# EAGLE design 1u_debug_breakout (EAGLE 9.3.2)
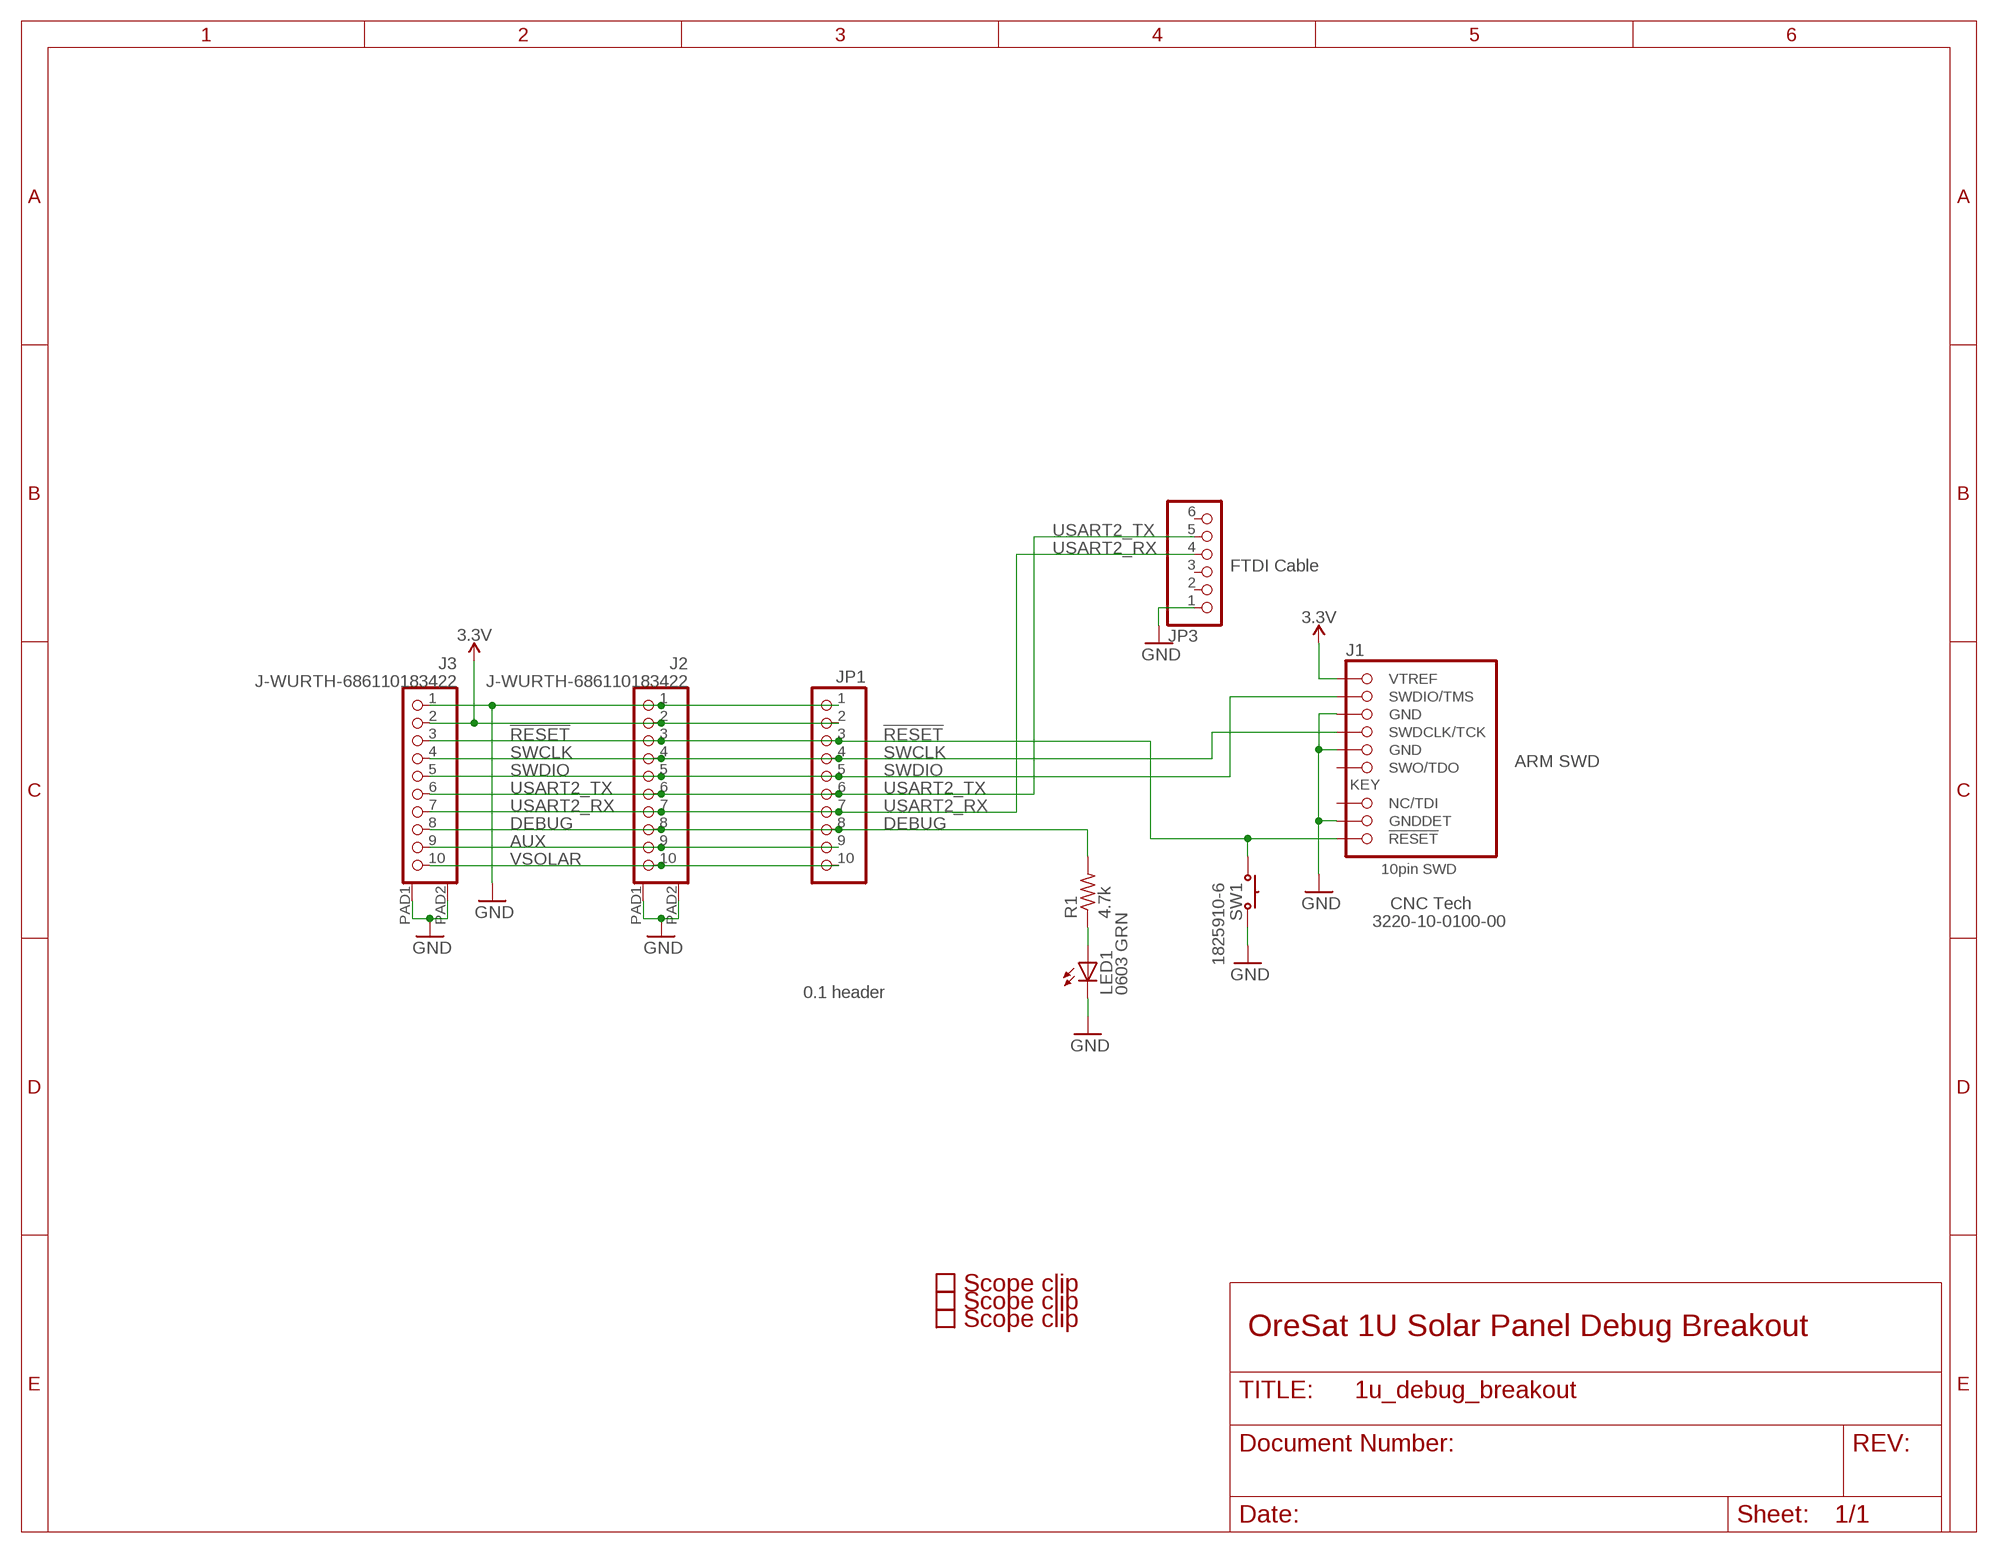
[diagram p0: schematic, sheet 1]

## Parts
J1  1.27MM-SWD-CONNECTOR  [1.27MM_2X5]
J2  J-WURTH-686110183422  [J-WURTH-686110183422]
J3  J-WURTH-686110183422  [J-WURTH-686110183422]
JP1  PINHD-1X10  [1X10]
JP3  PINHD-1X6  [1X06]
LED1  0603 GRN  LEDCHIPLED_0603  [CHIPLED_0603]
R1  4.7k  R-US_R0603  [R0603]
SW1  1825910-6  [SWITCH_FSM4JAH]
U$1  SCOPE_CLIP  [SCOPE_CLIP]
U$2  SCOPE_CLIP  [SCOPE_CLIP]
U$3  SCOPE_CLIP  [SCOPE_CLIP]

## Nets
3.3V: J1.VTREF J2.2 J3.2 JP1.2
!RESET: J1.!RESET J2.3 J3.3 JP1.3 SW1.1 SW1.2
AUX: J2.9 J3.9 JP1.9
DEBUG: J2.8 J3.8 JP1.8 R1.2
GND: J1.GND J1.GND@2(GND) J1.GNDDET J2.1 J2.PAD1 J2.PAD2 J3.1 J3.PAD1 J3.PAD2 JP1.1 JP3.1 LED1.C SW1.3 SW1.4
N$1: LED1.A R1.1
SWCLK: J1.SWDCLK(SWDCLK/TCK) J2.4 J3.4 JP1.4
SWDIO: J1.SWDIO(SWDIO/TMS) J2.5 J3.5 JP1.5
USART2_RX: J2.7 J3.7 JP1.7 JP3.4
USART2_TX: J2.6 J3.6 JP1.6 JP3.5
VSOLAR: J2.10 J3.10 JP1.10
Unconnected: J1.NC(NC/TDI) J1.SWO(SWO/TDO) JP3.2 JP3.3 JP3.6

## Notes on the sheet
- FTDI Cable
- ARM SWD
- 0.1 header
- OreSat 1U Solar Panel Debug Breakout

## Library data of the parts
J1 = J-CNC-3220-10-0100-00-ARM-SWD-port:1.27MM-SWD-CONNECTOR: ARM SWD Programming Header. Example part is the CNC 3220-10-0100-00; DIS: Digi-Key; DPN: 1175-1627-ND; MFR: CNC Tech; MPN: 3220-10-0100-00
J2 J3 = J-Wurth-686110183422-10pos-FFC:J-WURTH-686110183422
JP1 = pinhead:PINHD-1X10: PIN HEADER
JP3 = pinhead:PINHD-1X6: PIN HEADER
LED1 = led:LED: LED OSRAM: - CHIPLED LG R971, LG N971, LY N971, LG Q971, LY Q971, LO R971, LY R971 LH N974, LH R974 LS Q976, LO Q976, LY Q976 LO Q996 - Hyper CHIPLED LW Q18S LB Q993, LB Q99A, LB R99A - SideLED LS A670, LO A670, LY A670, LG A670, LP A670 LB A673, LV A673, LT A673, LW A673 LH A674 LY A675 LS A676, LA A676, LO A676, LY A676, LW A676 LS A679, LY A679, LG A679 - Hyper Micro SIDELED® LS Y876, LA Y876, LO Y876, LY Y876 LT Y87S - SmartLED LW L88C, LW L88S LB L89C, LB L89S, LG L890 LS L89K, LO L89K, LY L89K LS L896, LA L896, LO L896, LY L896 - TOPLED LS T670, LO T670, LY T670, LG T670, LP T670 LSG T670, LSP T670, LSY T670, LOP T670, LYG T670 LG T671, LOG T671, LSG T671 LB T673, LV T673, LT T673, LW T673 LH T674 LS T676, LA T676, LO T676, LY T676, LB T676, LH T676, LSB T676, LW T676 LB T67C, LV T67C, LT T67C, LS T67K, LO T67K, LY T67K, LW E67C LS E67B, LA E67B, LO E67B, LY E67B, LB E67C, LV E67C, LT E67C LW T67C LS T679, LY T679, LG T679 LS T770, LO T770, LY T770, LG T770, LP T770 LB T773, LV T773, LT T773, LW T773 LH T774 LS E675, LA E675, LY E675, LS T675 LS T776, LA T776, LO T776, LY T776, LB T776 LHGB T686 LT T68C, LB T68C - Hyper Mini TOPLED® LB M676 - Mini TOPLED Santana® LG M470 LS M47K, LO M47K, LY M47K Source: http://www.osram.convergy.de LUXEON: - LUMILED® LXK2-PW12-R00, LXK2-PW12-S00, LXK2-PW14-U00, LXK2-PW14-V00 LXK2-PM12-R00, LXK2-PM12-S00, LXK2-PM14-U00 LXK2-PE12-Q00, LXK2-PE12-R00, LXK2-PE12-S00, LXK2-PE14-T00, LXK2-PE14-U00 LXK2-PB12-K00, LXK2-PB12-L00, LXK2-PB12-M00, LXK2-PB14-N00, LXK2-PB14-P00, LXK2-PB14-Q00 LXK2-PR12-L00, LXK2-PR12-M00, LXK2-PR14-Q00, LXK2-PR14-R00 LXK2-PD12-Q00, LXK2-PD12-R00, LXK2-PD12-S00 LXK2-PH12-R00, LXK2-PH12-S00 LXK2-PL12-P00, LXK2-PL12-Q00, LXK2-PL12-R00 Source: www.luxeon.com KINGBRIGHT: KA-3528ASYC Source: www.kingbright.com
R1 = resistor:R-US_: RESISTOR, American symbol
SW1 = SW-TE-1825910-6mm-switch:1825910-6
U$1-U$3 = oresat-misc:SCOPE_CLIP: Ground clip pad for scope

## Board
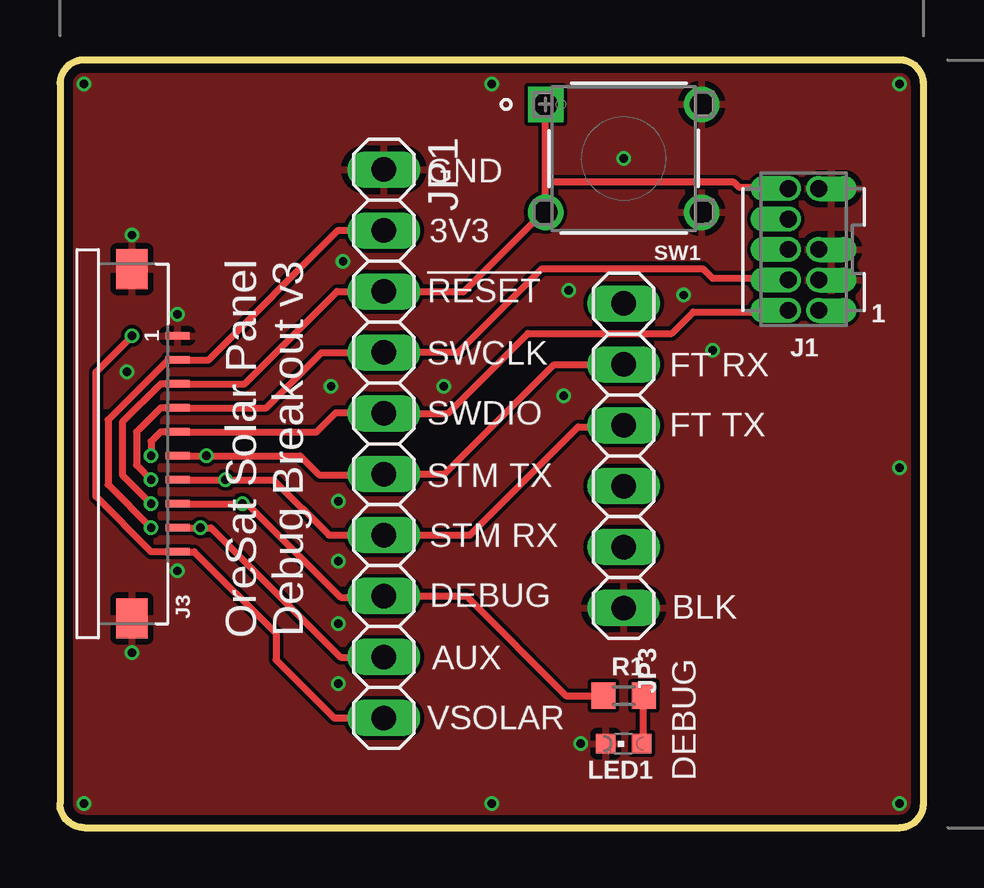
[diagram p1: board, top side]
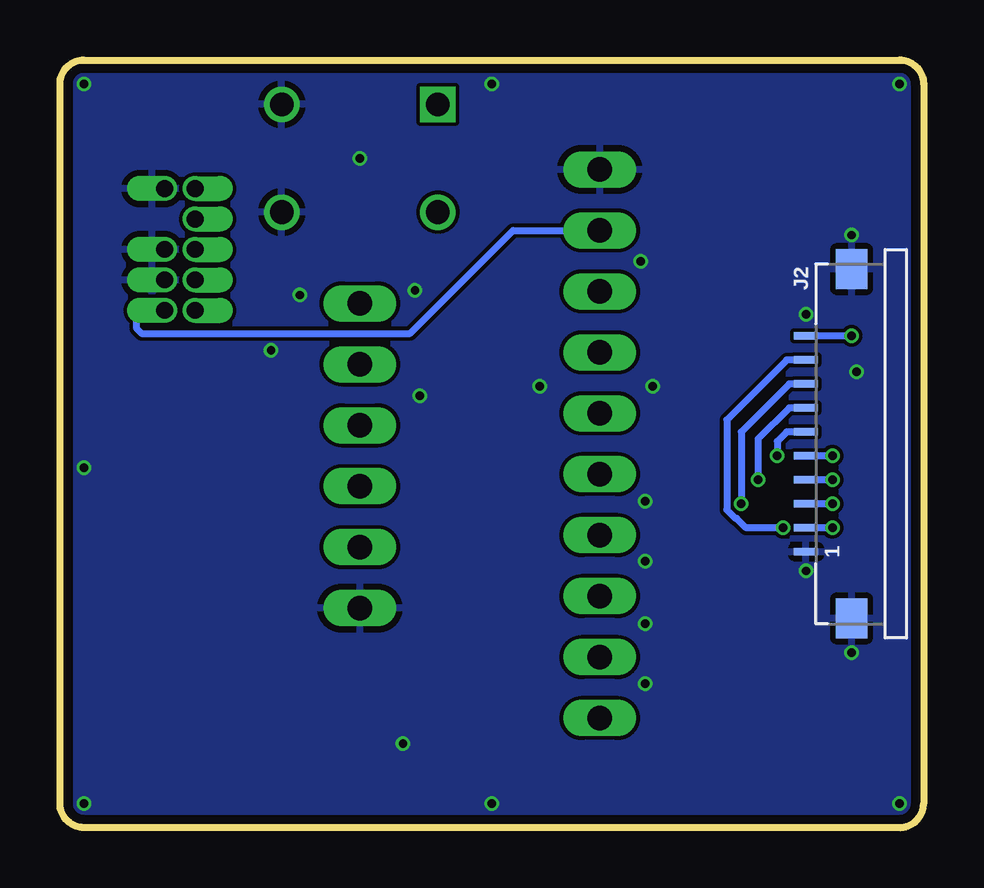
[diagram p2: board, bottom side, seen from below]

Size 36 x 32 mm. Coordinates in mm from the lower left corner, seen from the top.
Outline: 35,0 arc90 36,1 36,31 arc90 35,32 1,32 arc90 0,31 0,1 arc90 1,0 35,0
Copper layers (1*16): Top 0.035559375mm / dielectric 1.6mm / Bottom 0.035559375mm
Design rules "oshpark-2layer-tented": minimum track width 6mil, minimum drill 10mil, track to track 6mil, track to pad 6mil, pad to pad 6mil, via to via 6mil, smd to smd 6mil, copper to edge 15mil, drill to drill 6mil, minimum pad ring 5mil, minimum via ring 5mil, stop-mask expansion 2.5mil, vias tented up to drill 20mil, thermal gap 10mil

### Footprints (pad centres in the part's own frame; a part is rotated, then mirrored left to right if it is on the bottom)
1.27MM_2X5 = drill 0.7 pad 1.016 offset: !RESET 0.635,-2.54; GND -0.635,1.27; GND@2 -0.635,0; GNDDET -0.635,-2.54; NC 0.635,-1.27; SWDCLK 0.635,1.27; SWDIO 0.635,2.54; SWO 0.635,0; VTREF -0.635,2.54
J-WURTH-686110183422 = smd 0.3 x 1: 1 -4.5,1.9; 2 -3.5,1.9; 3 -2.5,1.9; 4 -1.5,1.9; 5 -0.5,1.9; 6 0.5,1.9; 7 1.5,1.9; 8 2.5,1.9; 9 3.5,1.9; 10 4.5,1.9 | smd 1.65 x 1.3: PAD1 -7.28,0; PAD2 7.28,0
1X10 = drill 1.016 long: 1 -11.43,0; 2 -8.89,0; 3 -6.35,0; 4 -3.81,0; 5 -1.27,0; 6 1.27,0; 7 3.81,0; 8 6.35,0; 9 8.89,0; 10 11.43,0
1X06 = drill 1.016 long: 1 -6.35,0; 2 -3.81,0; 3 -1.27,0; 4 1.27,0; 5 3.81,0; 6 6.35,0
CHIPLED_0603 = smd 0.8 x 0.8: A 0,-0.75; C 0,0.75
R0603 = smd 1 x 1.1: 1 -0.85,0; 2 0.85,0
SWITCH_FSM4JAH = drill 0.991 square: 1 -3.251,2.248 | drill 0.991: 2 -3.251,-2.248; 3 3.251,-2.248; 4 3.251,2.248

### Placement (x,y rotation side)
J1  31,24.1 180 top
J2  3,16 90 bottom
J3  3,16 270 top
JP1  13.5,16 270 top
JP3  23.5,15.5 90 top
LED1  23.5,3.5 90 top
R1  23.5,5.5 180 top
SW1  23.5,27.9 0 top
U$1  31.5,30 90 top
U$2  34,15 0 top
U$3  31.9,2 90 top

### Tracks (layer width: path | path; a pad name or v marks a point on that pad's centre or on a via)
3.3V  (via drill 0.35)
  Top 0.3: JP1.2 11.6,24.9 6.2,19.5 J3.2 4.5,19.5 2,17 2,14.3 v3.8,12.5
  Bottom 0.3: J1.VTREF 31.54,21.4 32.8,21.4 32.8,20.8 32.6,20.6 21.4,20.6 17.11,24.89 JP1.2 | v3.8,12.5 J2.2
!RESET  (via drill 0.35)
  Top 0.3: J1.!RESET 30.3,26.7 28.3,26.7 28.1,26.9 20.35,26.9 20.25,27 | SW1.1 20.3,30.2 SW1.1 20.25,27 | 20.25,27 SW1.2 20.2,25.7 16.85,22.35 JP1.3 11.55,22.35 7.7,18.5 J3.3 4.2,18.5 2.6,16.9 2.6,14.7 v3.8,13.5
  Bottom 0.3: v3.8,13.5 J2.3
AUX  (via drill 0.35)
  Top 0.3: J3.9 v5.85,12.5 6.3,12.5 11.7,7.1 JP1.9
  Bottom 0.3: J2.9 5.7,19.5 8.2,17 8.2,13.25 7.85,12.9 7.8,12.9 7.4,12.5 v5.85,12.5
DEBUG  (via drill 0.35)
  Top 0.3: R1.2 21.1,5.5 16.95,9.65 JP1.8 13.45,9.6 11.7,9.6 7.8,13.5 v7.6,13.5 J3.8
  Bottom 0.3: J2.8 5.6,18.5 7.6,16.5 v7.6,13.5
GND  (via drill 0.35)
  other vias: 1,1 1,31 35,1 35,31 18,1 21,18 2.8,19 4.9,21.4 4.9,10.7 3,24.7 3,7.3 11.8,23.6 11.6,13.6 11.3,18.4 16,18.4 21.2,22.4 26,22.2 23.5,27.9 11.6,11.1 11.6,8.5 11.6,6 35,15 18,31 27.2,19.9 21.7,3.5
  pour Top: 35,32 1,32 arc90 0,31 0,1 arc90 1,0 35,0 arc90 36,1 36,31 arc90
  pour Bottom: 35,32 1,32 arc90 0,31 0,1 arc90 1,0 35,0 arc90 36,1 36,31 arc90
N$1
  Top 0.3: LED1.A 24.3,3.5 24.3,5.5 R1.1
SWCLK  (via drill 0.35)
  Top 0.3: J1.SWDCLK 30.3,22.9 27.2,22.9 26.8,23.3 20.1,23.3 16.6,19.8 JP1.4 | JP1.4 10.9,19.8 8.6,17.5 J3.4 4.2,17.5 3.2,16.5 3.2,15.1 v3.8,14.5 | JP1.4
  Bottom 0.3: v3.8,14.5 J2.4
SWDIO  (via drill 0.35)
  Top 0.3: J1.SWDIO 30.3,21.5 26.4,21.5 25.5,20.6 19.5,20.6 16.17,17.27 JP1.5 13.47,17.3 11.5,17.3 10.7,16.5 J3.5 4.2,16.5 3.8,16.1 v3.8,15.5
  Bottom 0.3: v3.8,15.5 J2.5
USART2_RX  (via drill 0.35)
  Top 0.3: JP3.4 23.5,16.7 21.6,16.7 17.09,12.19 JP1.7 11.21,12.19 8.9,14.5 v6.9,14.5 J3.7
  Bottom 0.3: J2.7 5.6,17.5 6.9,16.2 v6.9,14.5
USART2_TX  (via drill 0.35)
  Top 0.3: JP3.5 20.6,19.3 16.03,14.73 JP1.6 13.47,14.7 10.8,14.7 10,15.5 v6.1,15.5 J3.6
  Bottom 0.3: J2.6 5.7,16.5 6.1,16.1 v6.1,15.5
VSOLAR  (via drill 0.35)
  Top 0.3: JP1.10 11.43,4.57 9,7 9,8.1 5.6,11.5 J3.10 3.8,11.5 1.5,13.8 1.5,19 v3,20.5
  Bottom 0.3: v3,20.5 J2.10

### Text on the board
tPlace: GND | 3V3 | !RESET | SWCLK | FT RX | SWDIO | FT TX | OreSat Solar Panel / Debug Breakout v3 | STM TX | STM RX | DEBUG | BLK | AUX | VSOLAR | DEBUG